# Altium schematic sheet Sheet1.SchDoc
size A4
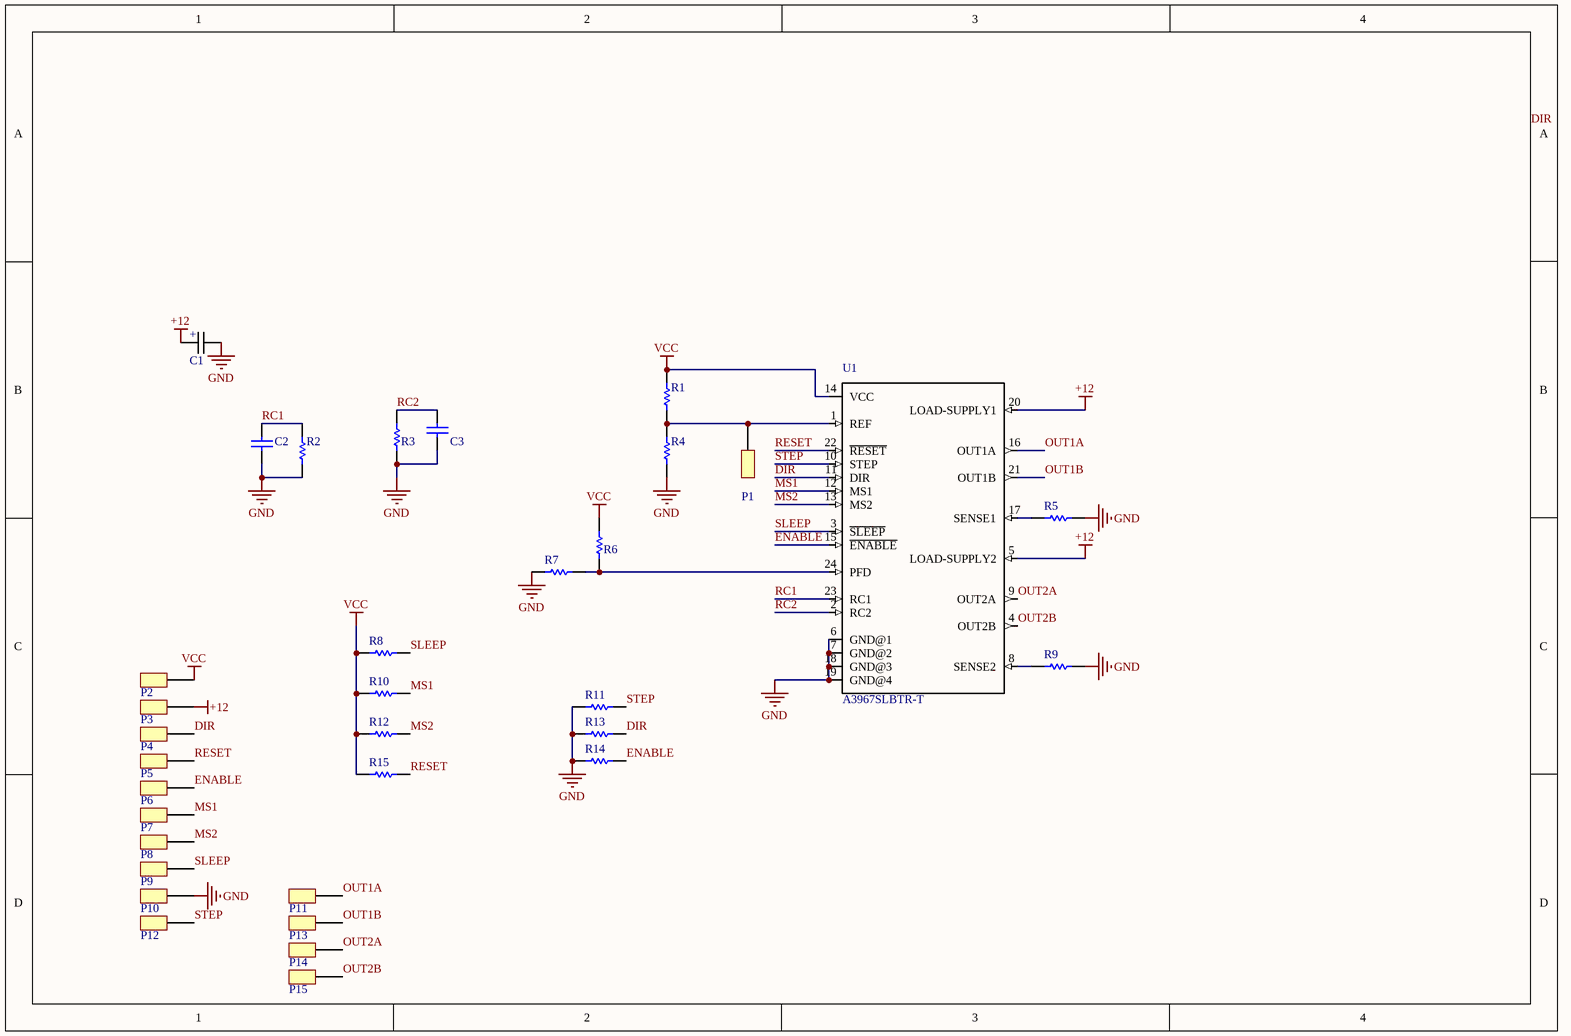
[diagram p0: Sheet1.SchDoc]

## Parts
C1  (no value)  [CAP 865080342006]
C2  CAP 680pF 16V 0603(1608)  [CAPC0603(1608)100_M]  (value not drawn)
C3  CAP 680pF 16V 0603(1608)  [CAPC0603(1608)100_M]  (value not drawn)
P1  Pin 100mil  [Pin 100mil]  (value not drawn)
P2  Pin 100mil  [Pin 100mil]  (value not drawn)
P3  Pin 100mil  [Pin 100mil]  (value not drawn)
P4  Pin 100mil  [Pin 100mil]  (value not drawn)
P5  Pin 100mil  [Pin 100mil]  (value not drawn)
P6  Pin 100mil  [Pin 100mil]  (value not drawn)
P7  Pin 100mil  [Pin 100mil]  (value not drawn)
P8  Pin 100mil  [Pin 100mil]  (value not drawn)
P9  Pin 100mil  [Pin 100mil]  (value not drawn)
P10  Pin 100mil  [Pin 100mil]  (value not drawn)
P11  Pin 100mil  [Pin 100mil]  (value not drawn)
P12  Pin 100mil  [Pin 100mil]  (value not drawn)
P13  Pin 100mil  [Pin 100mil]  (value not drawn)
P14  Pin 100mil  [Pin 100mil]  (value not drawn)
P15  Pin 100mil  [Pin 100mil]  (value not drawn)
R1  6K04 1% 0603(1608)  [RESC0603(1608)_M]  (value not drawn)
R2  20K 5% 0603(1608)  [RESC0603(1608)_N]  (value not drawn)
R3  20K 5% 0603(1608)  [RESC0603(1608)_N]  (value not drawn)
R4  4K02 1% 0603(1608)  [RESC0603(1608)_M]  (value not drawn)
R5  Jumper 0603(1608)  [RESC0603(1608)_N]  (value not drawn)
R6  10K 1% 0603(1608)  [RESC0603(1608)_N]  (value not drawn)
R7  6K8 1% 0603(1608)  [RESC0603(1608)_M]  (value not drawn)
R8  10K 1% 0603(1608)  [RESC0603(1608)_N]  (value not drawn)
R9  Jumper 0603(1608)  [RESC0603(1608)_N]  (value not drawn)
R10  10K 1% 0603(1608)  [RESC0603(1608)_N]  (value not drawn)
R11  10K 1% 0603(1608)  [RESC0603(1608)_N]  (value not drawn)
R12  10K 1% 0603(1608)  [RESC0603(1608)_N]  (value not drawn)
R13  10K 1% 0603(1608)  [RESC0603(1608)_N]  (value not drawn)
R14  10K 1% 0603(1608)  [RESC0603(1608)_N]  (value not drawn)
R15  10K 1% 0603(1608)  [RESC0603(1608)_N]  (value not drawn)
U1  A3967SLBTR-T  [*SOIC24WIDE]

## Nets
+12: C1.+ P3.0 U1.5(LOAD-SUPPLY2) U1.20(LOAD-SUPPLY1)
GND: C1.- C2.1 C3.1 P10.0 R2.1 R3.1 R4.1 R5.2 R7.1 R9.2 R11.1 R13.1 R14.1 U1.6(GND@1) U1.7(GND@2) U1.18(GND@3) U1.19(GND@4)
VCC: P2.0 R1.2 R6.2 R8.1 R10.1 R12.1 R15.1 U1.14(VCC)
DIR: P4.0 R13.2 U1.11(DIR)
ENABLE: P6.0 R14.2 U1.15(~{ENABLE})
MS1: P7.0 R10.2 U1.12(MS1)
MS2: P8.0 R12.2 U1.13(MS2)
OUT1A: P11.0 U1.16(OUT1A)
OUT1B: P13.0 U1.21(OUT1B)
OUT2A: P14.0 U1.9(OUT2A)
OUT2B: P15.0 U1.4(OUT2B)
RC1: C2.2 R2.2 U1.23(RC1)
RC2: C3.2 R3.2 U1.2(RC2)
RESET: P5.0 R15.2 U1.22(~{RESET})
SLEEP: P9.0 R8.2 U1.3(~{SLEEP})
STEP: P12.0 R11.2 U1.10(STEP)
NetP1_0: P1.0 R1.1 R4.2 U1.1(REF)
NetR5_1: R5.1 U1.17(SENSE1)
NetR6_1: R6.1 R7.2 U1.24(PFD)
NetR9_1: R9.1 U1.8(SENSE2)

## Notes on the sheet
- Labels drawn without touching a wire or pin: DIR

## Library data of the parts
C1 = CAP: pin to pad: +>1 ->2
C2 C3 = CMP-1035-01773-1: CAP 680pF 16V ±10% 0603 (1608 Metric) Thickness 1mm SMD; Case-EIA: 0603; Case-Metric: 1608; Tolerance: Â±10%; Value: 680pF; Technology: SMT; Rated Voltage: 16 V; Max Thickness: 1 mm
P1-P15 = 1-Pin
R1 = CMP-1012-00598-1: 6K04 0.1W 1% 0603 (1608 Metric)  SMD; Case-Metric: 1608; Value: 6040.00 Ohm; Case-EIA: 0603; Technology: SMT; Tolerance: 1 %; Power: 0.1 W
R2 R3 = CMP-1012-00105-1: 20K 0.1W 5% 0603 (1608 Metric)  SMD; Case-Metric: 1608; Value: 20000.00 Ohm; Case-EIA: 0603; Technology: SMT; Tolerance: 5 %; Power: 0.1 W
R4 = CMP-1012-00578-1: 4K02 0.1W 1% 0603 (1608 Metric)  SMD; Case-EIA: 0603; Case-Metric: 1608; Value: 4020.00 Ohm; Tolerance: 1 %; Technology: SMT; Power: 0.1 W
R5 R9 = CMP-1012-00001-1: Jumper 0603 (1608 Metric); Case-Metric: 1608; Value: 0.00 Ohm; Power: None; Case-EIA: 0603; Technology: SMT; Tolerance: None
R6 R8 R10-R15 = CMP-1012-00623-1: 10K 0.1W 1% 0603 (1608 Metric)  SMD; Value: 10000.00 Ohm; Case-EIA: 0603; Case-Metric: 1608; Power: 0.1 W; Tolerance: 1 %; Technology: SMT
R7 = CMP-1012-00604-1: 6K8 0.1W 1% 0603 (1608 Metric)  SMD; Value: 6800.00 Ohm; Case-Metric: 1608; Case-EIA: 0603; Technology: SMT; Power: 0.1 W; Tolerance: 1 %
U1 = A3967SLBTR-T: Ic Motor Driver Pwm Full 24soic - A3967slbtr-t; MF: Allegro; Digi-Key_Part_Number: 620-1140-1-ND; Package: SOIC-24 Allegro MicroSystems LLC; MP: A3967SLBTR-T; Digi-Key_Purchase_URL: https://www.digikey.com/product-detail/en/allegro-microsystems/A3967SLBTR-T/620-1140-1-ND/1090383?utm_source=snapeda&utm_medium=aggregator&utm_campaign=symbol; SnapEDA_Link: https://www.snapeda.com/parts/A3967SLBTR-T/Allegro%20Industries/view-part/?ref=snap; Value: *